# EAGLE design nhs hull (EAGLE 5.10)
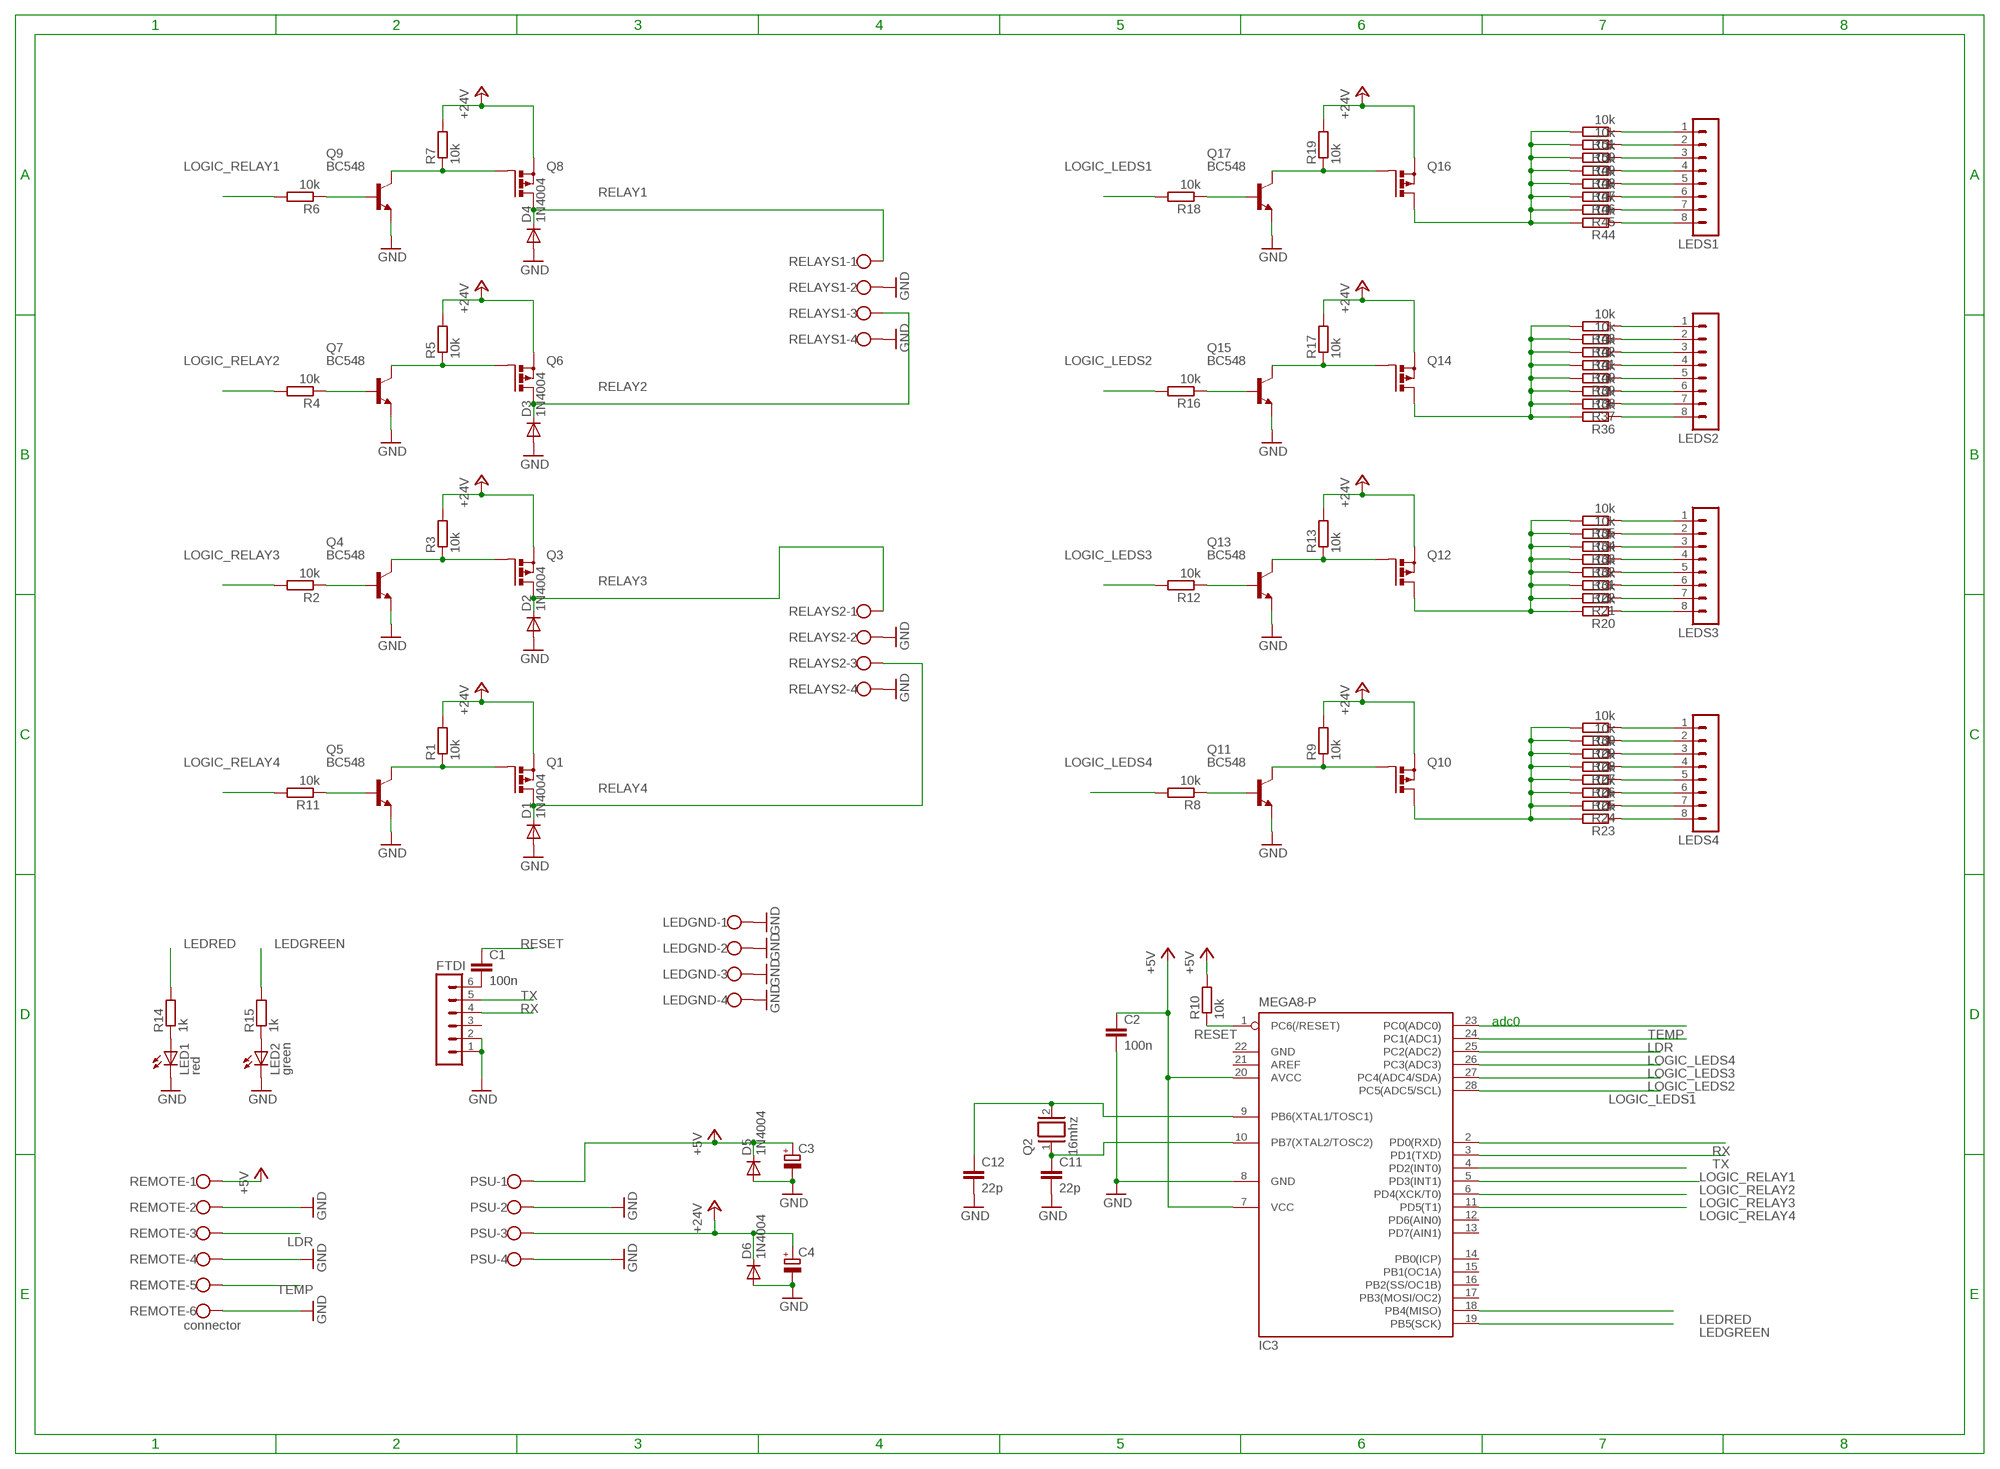
[diagram p0: schematic, sheet 1]

## Parts
C1  100n  C5/2.5  [C5B2.5]
C2  100n  C5/2.5  [C5B2.5]
C3  CPOL-EUE3.5-10  [E3,5-10]
C4  CPOL-EUE3.5-10  [E3,5-10]
C11  22p  C-EU050-025X075  [C050-025X075]
C12  22p  C-EU050-025X075  [C050-025X075]
D1  1N4004  [DO41-10]
D2  1N4004  [DO41-10]
D3  1N4004  [DO41-10]
D4  1N4004  [DO41-10]
D5  1N4004  [DO41-10]
D6  1N4004  [DO41-10]
FTDI  MA06-1  [MA06-1]
IC3  MEGA8-P  [DIL28-3]
LED1  red  LED5MM  [LED5MM]
LED2  green  LED5MM  [LED5MM]
LEDGND  W237-4  [W237-4]
LEDS1  MA08-1  [MA08-1]
LEDS2  MA08-1  [MA08-1]
LEDS3  MA08-1  [MA08-1]
LEDS4  MA08-1  [MA08-1]
PSU  W237-4  [W237-4]
Q1  PMOSFET_PTO220BV  [TO220BV]
Q2  16mhz  XTAL/S  [QS]
Q3  PMOSFET_PTO220BV  [TO220BV]
Q4  BC548  [TO92-EBC]
Q5  BC548  [TO92-EBC]
Q6  PMOSFET_PTO220BV  [TO220BV]
Q7  BC548  [TO92-EBC]
Q8  PMOSFET_PTO220BV  [TO220BV]
Q9  BC548  [TO92-EBC]
Q10  PMOSFET_PTO220BV  [TO220BV]
Q11  BC548  [TO92-EBC]
Q12  PMOSFET_PTO220BV  [TO220BV]
Q13  BC548  [TO92-EBC]
Q14  PMOSFET_PTO220BV  [TO220BV]
Q15  BC548  [TO92-EBC]
Q16  PMOSFET_PTO220BV  [TO220BV]
Q17  BC548  [TO92-EBC]
R1  10k  R-EU_0204/7  [0204/7]
R2  10k  R-EU_0204/7  [0204/7]
R3  10k  R-EU_0204/7  [0204/7]
R4  10k  R-EU_0204/7  [0204/7]
R5  10k  R-EU_0204/7  [0204/7]
R6  10k  R-EU_0204/7  [0204/7]
R7  10k  R-EU_0204/7  [0204/7]
R8  10k  R-EU_0204/7  [0204/7]
R9  10k  R-EU_0204/7  [0204/7]
R10  10k  R-EU_0204/7  [0204/7]
R11  10k  R-EU_0204/7  [0204/7]
R12  10k  R-EU_0204/7  [0204/7]
R13  10k  R-EU_0204/7  [0204/7]
R14  1k  R-EU_0204/7  [0204/7]
R15  1k  R-EU_0204/7  [0204/7]
R16  10k  R-EU_0204/7  [0204/7]
R17  10k  R-EU_0204/7  [0204/7]
R18  10k  R-EU_0204/7  [0204/7]
R19  10k  R-EU_0204/7  [0204/7]
R20  10k  R-EU_0204/7  [0204/7]
R21  10k  R-EU_0204/7  [0204/7]
R22  10k  R-EU_0204/7  [0204/7]
R23  10k  R-EU_0204/7  [0204/7]
R24  10k  R-EU_0204/7  [0204/7]
R25  10k  R-EU_0204/7  [0204/7]
R26  10k  R-EU_0204/7  [0204/7]
R27  10k  R-EU_0204/7  [0204/7]
R28  10k  R-EU_0204/7  [0204/7]
R29  10k  R-EU_0204/7  [0204/7]
R30  10k  R-EU_0204/7  [0204/7]
R31  10k  R-EU_0204/7  [0204/7]
R32  10k  R-EU_0204/7  [0204/7]
R33  10k  R-EU_0204/7  [0204/7]
R34  10k  R-EU_0204/7  [0204/7]
R35  10k  R-EU_0204/7  [0204/7]
R36  10k  R-EU_0204/7  [0204/7]
R37  10k  R-EU_0204/7  [0204/7]
R38  10k  R-EU_0204/7  [0204/7]
R39  10k  R-EU_0204/7  [0204/7]
R40  10k  R-EU_0204/7  [0204/7]
R41  10k  R-EU_0204/7  [0204/7]
R42  10k  R-EU_0204/7  [0204/7]
R43  10k  R-EU_0204/7  [0204/7]
R44  10k  R-EU_0204/7  [0204/7]
R45  10k  R-EU_0204/7  [0204/7]
R46  10k  R-EU_0204/7  [0204/7]
R47  10k  R-EU_0204/7  [0204/7]
R48  10k  R-EU_0204/7  [0204/7]
R49  10k  R-EU_0204/7  [0204/7]
R50  10k  R-EU_0204/7  [0204/7]
R51  10k  R-EU_0204/7  [0204/7]
RELAYS1  W237-4  [W237-4]
RELAYS2  W237-4  [W237-4]
REMOTE  connector  W237-6  [W237-6]

## Nets
+5V: C2.1 C3.+ D5.C IC3.7(VCC) IC3.20(AVCC) PSU.1 R10.2 REMOTE.1
+24V [power]: C4.+ D6.C PSU.3 Q1.S Q3.S Q6.S Q8.S Q10.S Q12.S Q14.S Q16.S R1.2 R3.2 R5.2 R7.2 R9.2 R13.2 R17.2 R19.2
GND: C2.2 C3.- C4.- C11.2 C12.2 D1.A D2.A D3.A D4.A D5.A D6.A FTDI.1 FTDI.2 IC3.8(GND) LED1.K(C) LED2.K(C) LEDGND.1 LEDGND.2 LEDGND.3 LEDGND.4 PSU.2 PSU.4 Q4.E Q5.E Q7.E Q9.E Q11.E Q13.E Q15.E Q17.E RELAYS1.2 RELAYS1.4 RELAYS2.2 RELAYS2.4 REMOTE.2 REMOTE.4 REMOTE.6
LDR [power]: IC3.24(PC1(ADC1)) REMOTE.3
LEDGREEN: IC3.19(PB5(SCK)) R15.2
LEDRED: IC3.18(PB4(MISO)) R14.2
LEDS4: Q10.D R23.2 R24.2 R25.2 R26.2 R27.2 R28.2 R29.2 R30.2
LOGIC_LEDS1: IC3.28(PC5(ADC5/SCL)) R18.2
LOGIC_LEDS2: IC3.27(PC4(ADC4/SDA)) R16.2
LOGIC_LEDS3: IC3.26(PC3(ADC3)) R12.2
LOGIC_LEDS4: IC3.25(PC2(ADC2)) R8.2
LOGIC_RELAY1: IC3.4(PD2(INT0)) R6.2
LOGIC_RELAY2: IC3.5(PD3(INT1)) R4.2
LOGIC_RELAY3: IC3.6(PD4(XCK/T0)) R2.2
LOGIC_RELAY4: IC3.11(PD5(T1)) R11.2
N$1: Q3.G Q4.C R3.1
N$2: Q1.G Q5.C R1.1
N$3: Q4.B R2.1
N$4: Q6.G Q7.C R5.1
N$5: C1.2 FTDI.6
N$6: Q7.B R4.1
N$7: Q8.G Q9.C R7.1
N$8: Q5.B R11.1
N$9: Q9.B R6.1
N$10: C11.1 IC3.10(PB7(XTAL2/TOSC2)) Q2.1
N$11: C12.1 IC3.9(PB6(XTAL1/TOSC1)) Q2.2
N$12: Q10.G Q11.C R9.1
N$13: LED1.A R14.1
N$14: Q11.B R8.1
N$15: LED2.A R15.1
N$16: Q12.G Q13.C R13.1
N$17: Q13.B R12.1
N$18: Q14.G Q15.C R17.1
N$19: Q15.B R16.1
N$20: Q16.G Q17.C R19.1
N$21: Q17.B R18.1
N$22: LEDS4.8 R23.1
N$23: LEDS4.7 R24.1
N$24: LEDS4.6 R25.1
N$27: LEDS4.5 R26.1
N$28: LEDS4.4 R27.1
N$29: LEDS4.3 R28.1
N$30: LEDS4.2 R29.1
N$31: LEDS4.1 R30.1
N$32: Q12.D R20.2 R21.2 R22.2 R31.2 R32.2 R33.2 R34.2 R35.2
N$33: LEDS3.8 R20.1
N$35: LEDS3.7 R21.1
N$37: LEDS3.6 R22.1
N$38: LEDS3.5 R31.1
N$39: LEDS3.4 R32.1
N$40: LEDS3.3 R33.1
N$41: LEDS3.2 R34.1
N$43: LEDS3.1 R35.1
N$44: Q14.D R36.2 R37.2 R38.2 R39.2 R40.2 R41.2 R42.2 R43.2
N$45: LEDS2.8 R36.1
N$46: LEDS2.7 R37.1
N$47: LEDS2.6 R38.1
N$48: LEDS2.5 R39.1
N$49: LEDS2.4 R40.1
N$50: LEDS2.3 R41.1
N$51: LEDS2.2 R42.1
N$52: LEDS2.1 R43.1
N$53: Q16.D R44.2 R45.2 R46.2 R47.2 R48.2 R49.2 R50.2 R51.2
N$54: LEDS1.8 R44.1
N$55: LEDS1.7 R45.1
N$56: LEDS1.6 R46.1
N$57: LEDS1.5 R47.1
N$58: LEDS1.4 R48.1
N$59: LEDS1.3 R49.1
N$60: LEDS1.2 R50.1
N$61: LEDS1.1 R51.1
RELAY1: D4.C Q8.D RELAYS1.1
RELAY2: D3.C Q6.D RELAYS1.3
RELAY3: D2.C Q3.D RELAYS2.1
RELAY4: D1.C Q1.D RELAYS2.3
RESET: C1.1 IC3.1(PC6(/RESET)) R10.1
RX: FTDI.4 IC3.2(PD0(RXD))
TEMP: IC3.23(PC0(ADC0)) REMOTE.5
TX: FTDI.5 IC3.3(PD1(TXD))
Unconnected: FTDI.3 IC3.12(PD6(AIN0)) IC3.13(PD7(AIN1)) IC3.14(PB0(ICP)) IC3.15(PB1(OC1A)) IC3.16(PB2(SS/OC1B)) IC3.17(PB3(MOSI/OC2)) IC3.21(AREF)

## Notes on the sheet
- adc0

## Power pins joined to a net without a drawn wire
GND: IC3.22(GND)

## Library data of the parts
C1 C2 = capacitor-wima:C: CAPACITOR naming: grid - package width
C3 C4 = rcl:CPOL-EU: POLARIZED CAPACITOR, European symbol
C11 C12 = rcl:C-EU: CAPACITOR, European symbol
D1-D6 = diode:1N4004: DIODE general purpose rectifier, 1 A
FTDI = con-lstb:MA06-1: PIN HEADER
IC3 = atmel:MEGA8-P: MICROCONTROLLER 8 Kbytes FLASH, 1 kbytes SRAM, 512 bytes EEPROM, USART, 4-channel 10 bit ADC, 2-channel 8 bit ADC Pin compatible with Atmega48, ATMega88, ATMega168 Source: avr.lbr
LED1 LED2 = led:LED: LED OSRAM: - CHIPLED LG R971, LG N971, LY N971, LG Q971, LY Q971, LO R971, LY R971 LH N974, LH R974 LS Q976, LO Q976, LY Q976 LO Q996 - Hyper CHIPLED LW Q18S LB Q993, LB Q99A, LB R99A - SideLED LS A670, LO A670, LY A670, LG A670, LP A670 LB A673, LV A673, LT A673, LW A673 LH A674 LY A675 LS A676, LA A676, LO A676, LY A676, LW A676 LS A679, LY A679, LG A679 - Hyper Micro SIDELED® LS Y876, LA Y876, LO Y876, LY Y876 LT Y87S - SmartLED LW L88C, LW L88S LB L89C, LB L89S, LG L890 LS L89K, LO L89K, LY L89K LS L896, LA L896, LO L896, LY L896 - TOPLED LS T670, LO T670, LY T670, LG T670, LP T670 LSG T670, LSP T670, LSY T670, LOP T670, LYG T670 LG T671, LOG T671, LSG T671 LB T673, LV T673, LT T673, LW T673 LH T674 LS T676, LA T676, LO T676, LY T676, LB T676, LH T676, LSB T676, LW T676 LB T67C, LV T67C, LT T67C, LS T67K, LO T67K, LY T67K, LW E67C LS E67B, LA E67B, LO E67B, LY E67B, LB E67C, LV E67C, LT E67C LW T67C LS T679, LY T679, LG T679 LS T770, LO T770, LY T770, LG T770, LP T770 LB T773, LV T773, LT T773, LW T773 LH T774 LS E675, LA E675, LY E675, LS T675 LS T776, LA T776, LO T776, LY T776, LB T776 LHGB T686 LT T68C, LB T68C - Hyper Mini TOPLED® LB M676 - Mini TOPLED Santana® LG M470 LS M47K, LO M47K, LY M47K Source: http://www.osram.convergy.de LUXEON: - LUMILED® LXK2-PW12-R00, LXK2-PW12-S00, LXK2-PW14-U00, LXK2-PW14-V00 LXK2-PM12-R00, LXK2-PM12-S00, LXK2-PM14-U00 LXK2-PE12-Q00, LXK2-PE12-R00, LXK2-PE12-S00, LXK2-PE14-T00, LXK2-PE14-U00 LXK2-PB12-K00, LXK2-PB12-L00, LXK2-PB12-M00, LXK2-PB14-N00, LXK2-PB14-P00, LXK2-PB14-Q00 LXK2-PR12-L00, LXK2-PR12-M00, LXK2-PR14-Q00, LXK2-PR14-R00 LXK2-PD12-Q00, LXK2-PD12-R00, LXK2-PD12-S00 LXK2-PH12-R00, LXK2-PH12-S00 LXK2-PL12-P00, LXK2-PL12-Q00, LXK2-PL12-R00 Source: www.luxeon.com KINGBRIGHT: KA-3528ASYC Source: www.kingbright.com
LEDGND PSU RELAYS1 RELAYS2 = con-wago-500:W237-4: WAGO SCREW CLAMP
LEDS1-LEDS4 = con-lstb:MA08-1: PIN HEADER
Q1 Q3 Q6 Q8 Q10 Q12 Q14 Q16 = transistor-power:PMOSFET_P: Power MOSFET P-Channel
Q2 = special:XTAL/S: CRYSTAL
Q4 Q5 Q7 Q9 Q11 Q13 Q15 Q17 = transistor-npn:BC548*: NPN Transistor
R1-R51 = rcl:R-EU_: RESISTOR, European symbol
REMOTE = con-wago-500:W237-6: WAGO SCREW CLAMP

## Net classes
1 power: width 2 mm

## Board
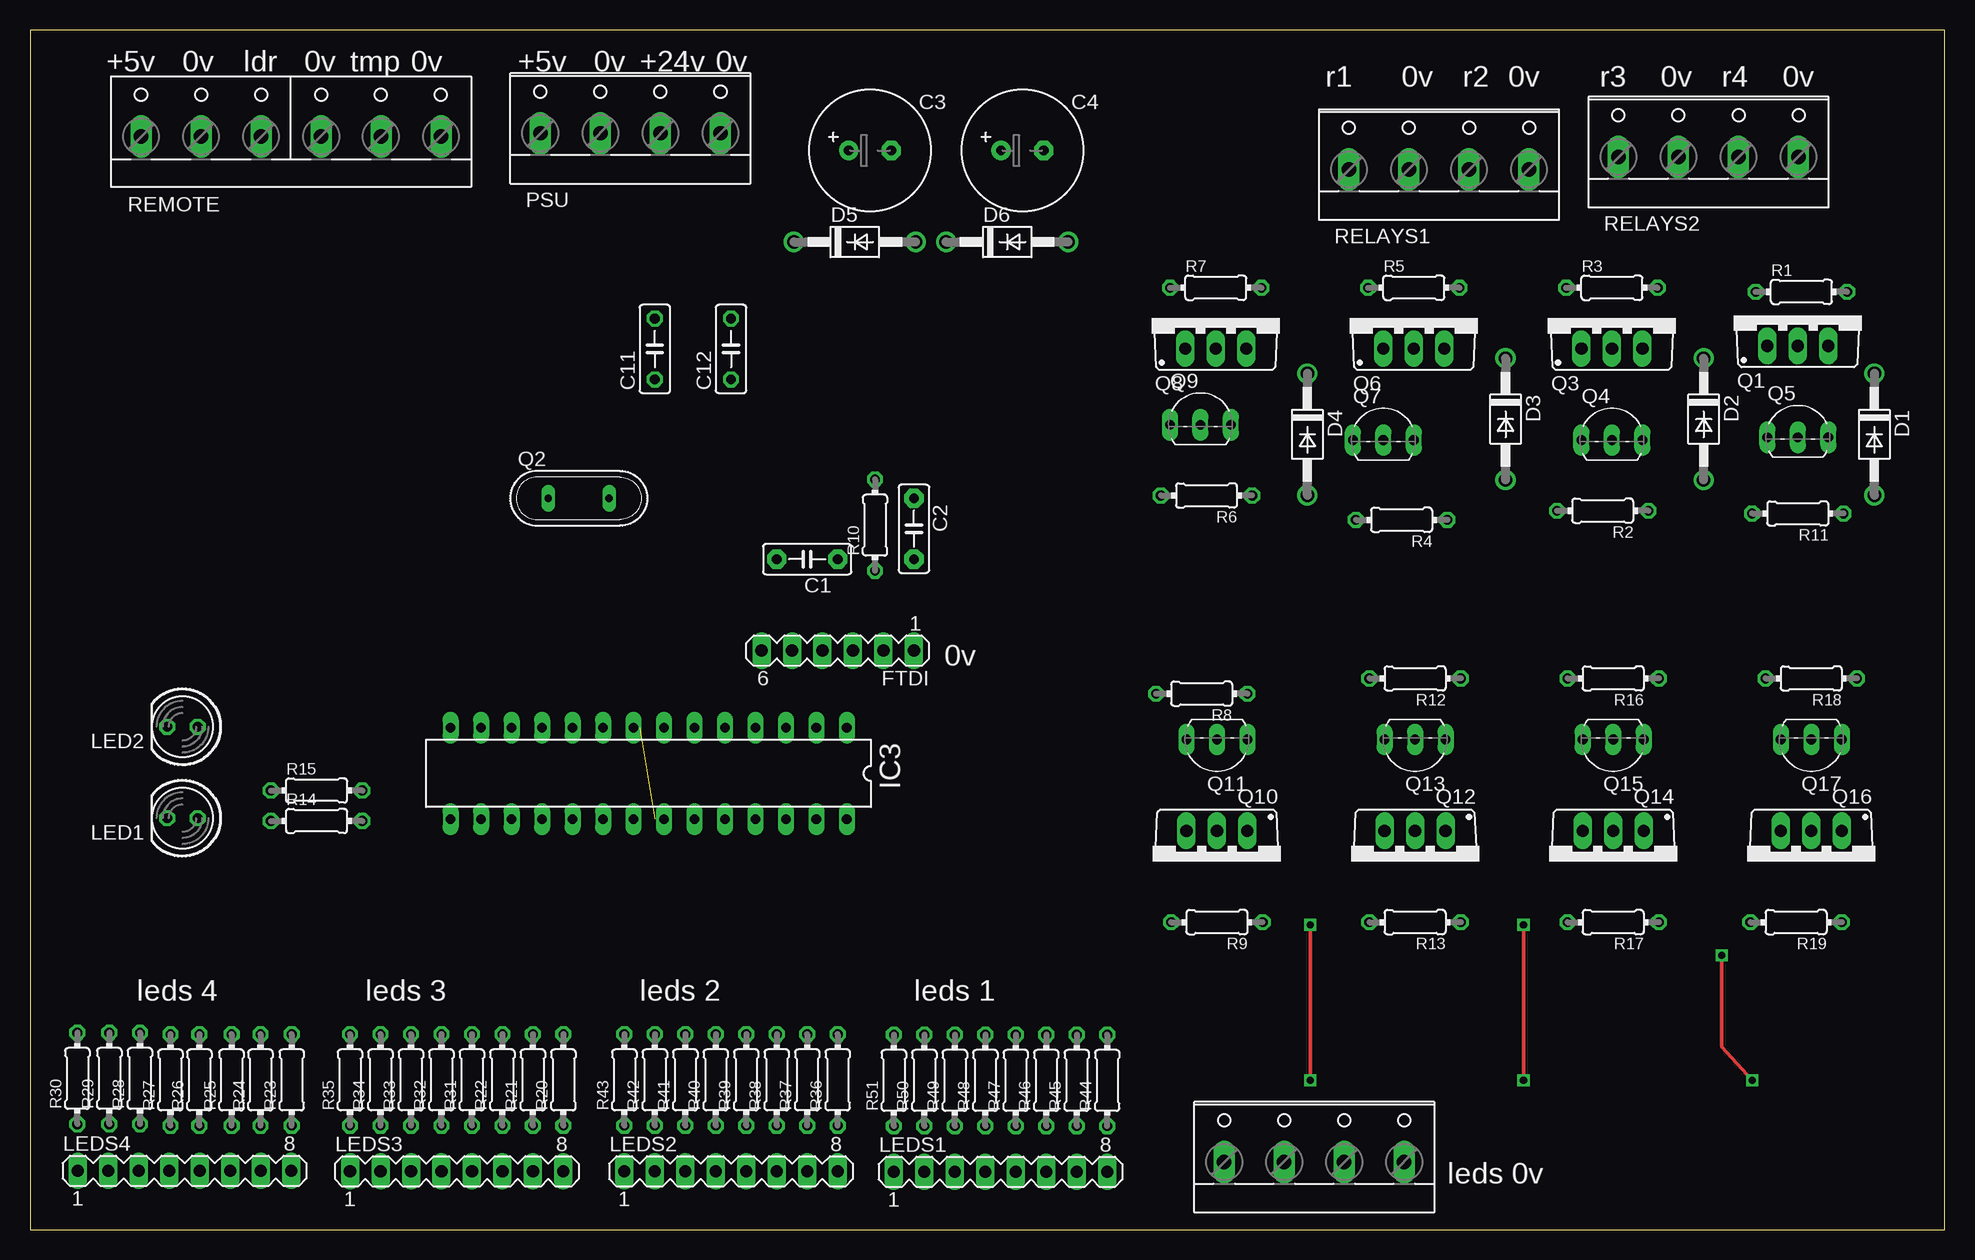
[diagram p1: board, top side]
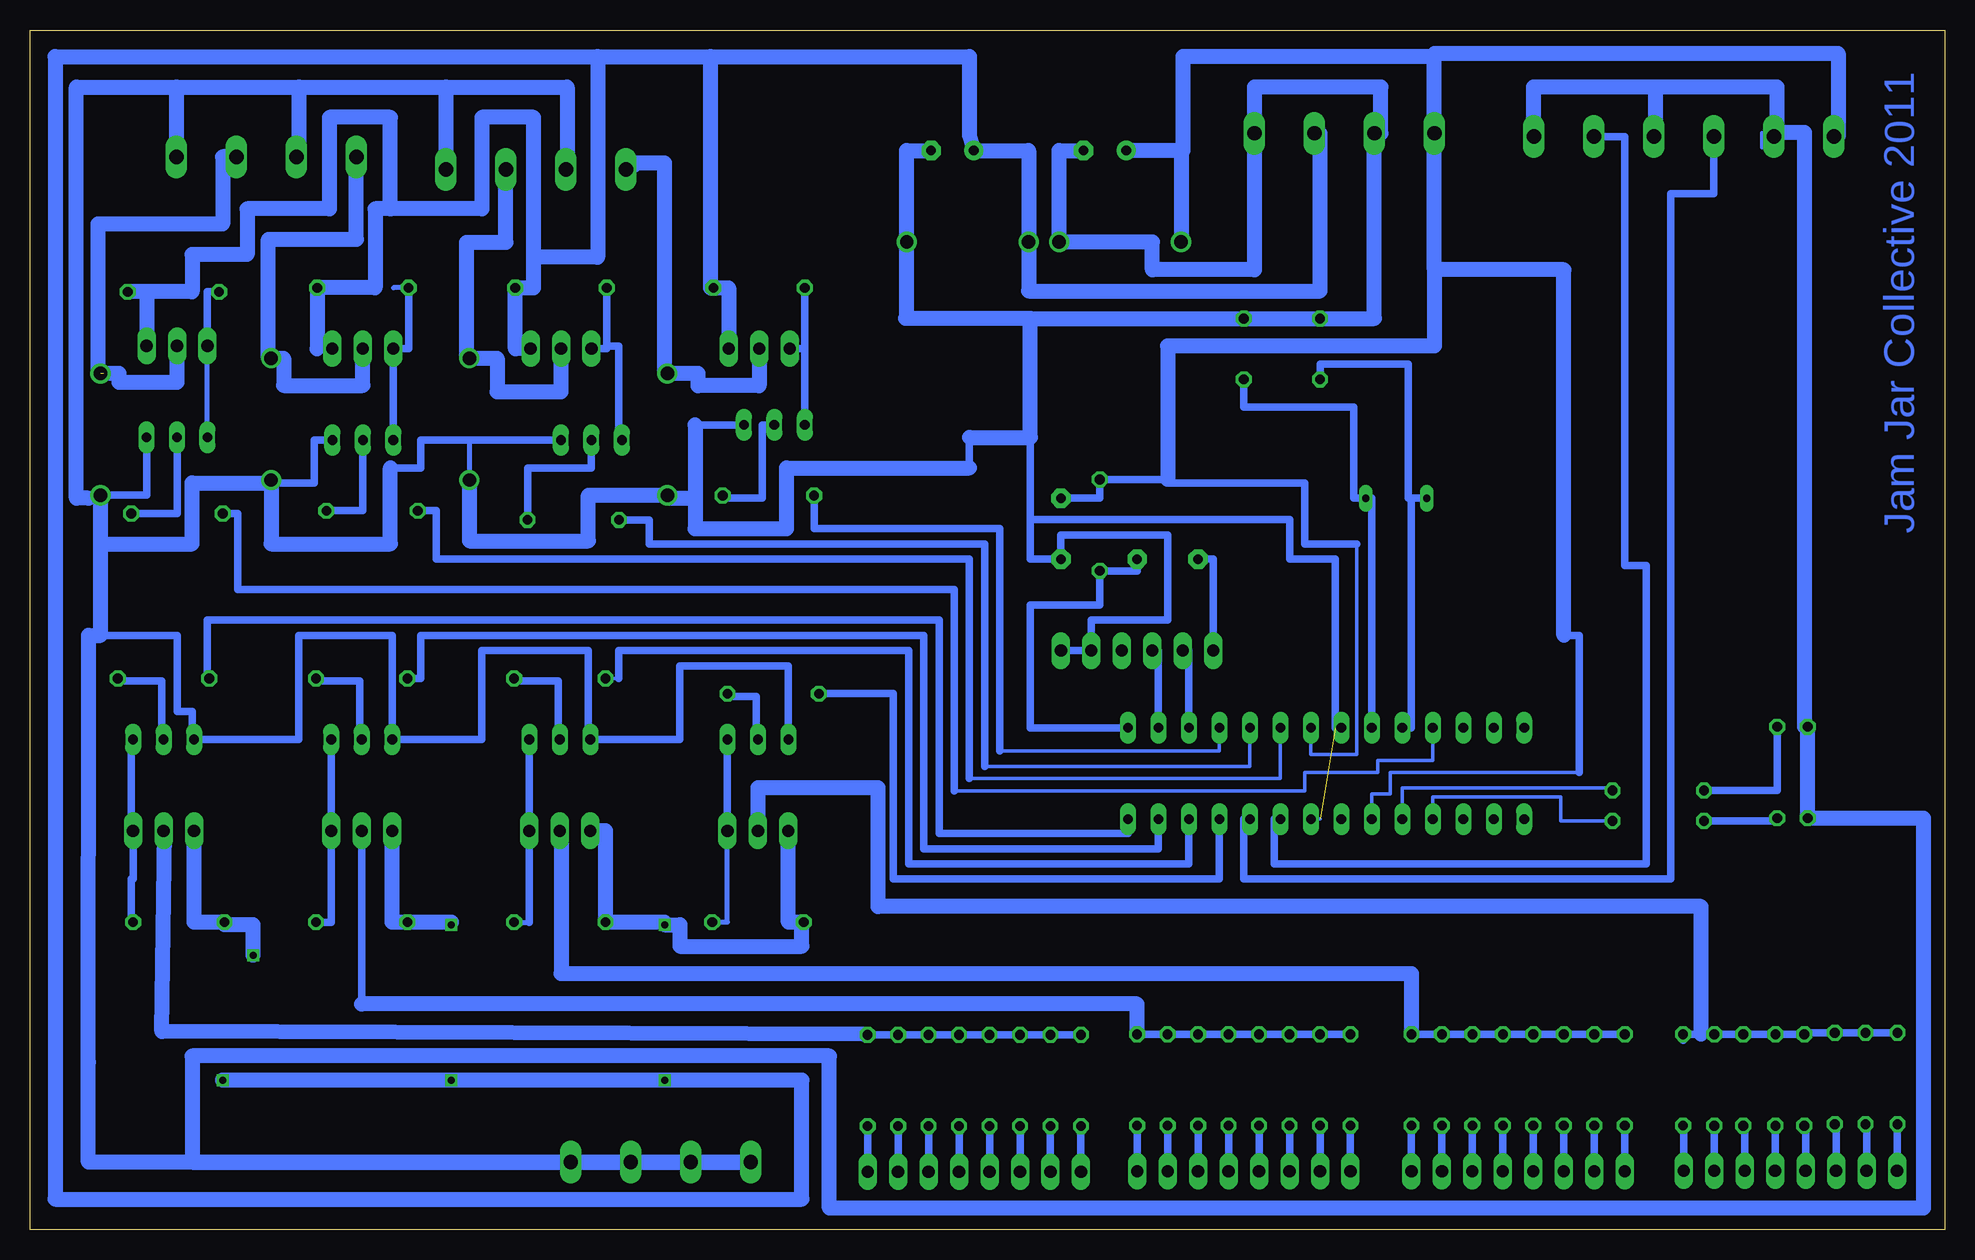
[diagram p2: board, bottom side, seen from below]

Size 159.57 x 100 mm. Coordinates in mm from the lower left corner, seen from the top.
Outline: 0,0 159.57,0 159.57,100 0,100 0,0
Copper layers (1*16): Top 0.035mm / dielectric 1.5mm / Bottom 0.035mm
Design rules "default": minimum track width 10mil, minimum drill 24mil, track to track 8mil, track to pad 8mil, pad to pad 8mil, via to via 8mil, smd to smd 8mil, copper to edge 40mil, drill to drill 8mil, minimum pad ring 10mil, minimum via ring 8mil, stop-mask expansion 4mil, vias tented up to drill 0mil, thermal gap 10mil

### Footprints (pad centres in the part's own frame; a part is rotated, then mirrored left to right if it is on the bottom)
C5B2.5 = drill 0.813 pad 1.6 octagon: 1 -2.54,0; 2 2.54,0
E3,5-10 = drill 0.813 pad 1.6 round: + -1.778,0 | drill 0.813 pad 1.6 octagon: - 1.778,0
C050-025X075 = drill 0.813 octagon: 1 -2.54,0; 2 2.54,0
DO41-10 = drill 1.118 round: A 5.08,0; C -5.08,0
MA06-1 = drill 1.016 long: 1 -6.35,0; 2 -3.81,0; 3 -1.27,0; 4 1.27,0; 5 3.81,0; 6 6.35,0
DIL28-3 = drill 0.813 long: 1 -16.51,-3.81; 2 -13.97,-3.81; 3 -11.43,-3.81; 4 -8.89,-3.81; 5 -6.35,-3.81; 6 -3.81,-3.81; 7 -1.27,-3.81; 8 1.27,-3.81; 9 3.81,-3.81; 10 6.35,-3.81; 11 8.89,-3.81; 12 11.43,-3.81; 13 13.97,-3.81; 14 16.51,-3.81; 15 16.51,3.81; 16 13.97,3.81; 17 11.43,3.81; 18 8.89,3.81; 19 6.35,3.81; 20 3.81,3.81; 21 1.27,3.81; 22 -1.27,3.81; 23 -3.81,3.81; 24 -6.35,3.81; 25 -8.89,3.81; 26 -11.43,3.81; 27 -13.97,3.81; 28 -16.51,3.81
LED5MM = drill 0.813 octagon: A -1.27,0; K 1.27,0
W237-4 = drill 1.194 long: 1 -7.5,-1.27; 2 -2.5,-1.27; 3 2.5,-1.27; 4 7.5,-1.27
MA08-1 = drill 1.016 long: 1 -8.89,0; 2 -6.35,0; 3 -3.81,0; 4 -1.27,0; 5 1.27,0; 6 3.81,0; 7 6.35,0; 8 8.89,0
TO220BV = drill 1.016 long: D 0,-2.54; G -2.54,-2.54; S 2.54,-2.54
QS = drill 0.61 long: 1 -2.54,0; 2 2.54,0
TO92-EBC = drill 0.813 long: B 0,-1.27; C -2.54,-1.27; E 2.54,-1.27
0204/7 = drill 0.813 octagon: 1 -3.81,0; 2 3.81,0
W237-6 = drill 1.194 long: 1 -12.5,-1.27; 2 -7.5,-1.27; 3 -2.5,-1.27; 4 2.5,-1.27; 5 7.5,-1.27; 6 12.5,-1.27

### Placement (x,y rotation side)
C1  64.77,55.88 180 top
C2  73.66,58.42 270 top
C3  70,89.95 0 top
C4  82.7,89.95 0 top
C11  52.07,73.41 90 top
C12  58.42,73.41 90 top
D1  153.69,66.29 270 top
D2  139.47,67.56 270 top
D3  122.96,67.56 270 top
D4  106.45,66.29 270 top
D5  68.73,82.33 0 top
D6  81.43,82.33 0 top
FTDI  67.31,48.26 180 top
IC3  51.56,38.02 180 top
LED1  12.7,34.29 180 top
LED2  12.7,41.91 180 top
LEDGND  107.01,6.89 0 top
LEDS1  80.88,4.8 0 top
LEDS2  58.42,4.85 0 top
LEDS3  35.56,4.85 0 top
LEDS4  12.88,4.89 0 top
PSU  50.03,92.66 0 top
Q1  147.32,76.2 0 top
Q2  45.72,60.96 0 top
Q3  131.83,75.97 0 top
Q4  131.83,67.08 0 top
Q5  147.32,67.31 0 top
Q6  115.32,75.97 0 top
Q7  112.78,67.08 0 top
Q8  98.81,75.97 0 top
Q9  97.54,68.35 0 top
Q10  98.91,30.7 180 top
Q11  98.91,39.59 180 top
Q12  115.42,30.7 180 top
Q13  115.42,39.59 180 top
Q14  131.93,30.7 180 top
Q15  131.93,39.59 180 top
Q16  148.44,30.7 180 top
Q17  148.44,39.59 180 top
R1  147.62,78.17 0 top
R2  131.06,59.92 180 top
R3  131.83,78.51 0 top
R4  114.3,59.16 180 top
R5  115.32,78.51 0 top
R6  98.04,61.19 180 top
R7  98.81,78.51 0 top
R8  97.64,44.67 180 top
R9  98.91,25.62 180 top
R10  70.42,58.72 90 top
R11  147.32,59.69 180 top
R12  115.42,45.94 180 top
R13  115.42,25.62 180 top
R14  23.88,34.06 0 top
R15  23.88,36.6 0 top
R16  131.93,45.94 180 top
R17  131.93,25.62 180 top
R18  148.44,45.94 180 top
R19  147.17,25.62 180 top
R20  44.45,12.47 90 top
R21  41.91,12.47 90 top
R22  39.37,12.47 90 top
R23  21.81,12.47 90 top
R24  19.21,12.46 90 top
R25  16.8,12.46 90 top
R26  14.12,12.46 90 top
R27  11.71,12.46 90 top
R28  9.17,12.59 90 top
R29  6.61,12.59 90 top
R30  3.95,12.59 90 top
R31  36.83,12.47 90 top
R32  34.29,12.47 90 top
R33  31.75,12.47 90 top
R34  29.21,12.47 90 top
R35  26.67,12.47 90 top
R36  67.31,12.47 90 top
R37  64.77,12.47 90 top
R38  62.23,12.47 90 top
R39  59.69,12.47 90 top
R40  57.15,12.47 90 top
R41  54.61,12.47 90 top
R42  52.07,12.47 90 top
R43  49.53,12.47 90 top
R44  89.77,12.43 90 top
R45  87.23,12.43 90 top
R46  84.69,12.43 90 top
R47  82.15,12.43 90 top
R48  79.61,12.43 90 top
R49  77.07,12.43 90 top
R50  74.53,12.43 90 top
R51  71.99,12.43 90 top
RELAYS1  117.41,89.64 0 top
RELAYS2  139.87,90.69 0 top
REMOTE  21.75,92.39 0 top

### Tracks (layer width: path | path; a pad name or v marks a point on that pad's centre or on a via)
+5V
  Bottom 0.305: IC3.7 52.83,39.62 49.02,39.62 49.02,57.15 | 64.77,62.53 64.77,62.23 | 48.26,34.21 IC3.20 47.75,36.32 46.23,36.32 46.23,38.1 30.48,38.1
  Bottom 0.406: C3.+ 63.65,89.95
  Bottom 0.61: C2.1 70.42,60.96 R10.2 64.77,62.53 | 49.02,57.15 53.34,57.15 53.34,62.23 64.77,62.23 | 30.48,38.1 30.48,49.53 31.75,49.53
  Bottom 1.27: 63.65,89.95 D5.C | C3.+ 63.5,89.95 63.5,97.79 42.53,97.79 | 42.53,97.79 PSU.1 42.53,80.01 | REMOTE.1 8.89,91.12 8.89,98.04 42.53,98.04 42.53,97.79 | 64.77,62.53 64.77,73.66 42.53,73.66 42.53,80.01 | 31.75,49.53 31.75,80.01 42.53,80.01
+24V  (via drill 0.6)
  Top 0.305: v143.51,12.45 140.97,15.24 v140.97,22.86 | v124.46,12.45 v124.46,25.4 | v106.68,12.45 v106.68,25.4
  Bottom 0.305: 143.36,25.4 R19.2 | v124.46,25.4 124.46,25.62 | 102.87,78.51 R7.2 | 95.25,25.62 R9.2
  Bottom 0.406: 52.07,91.39 PSU.3 | 129.39,25.62 R17.2
  Bottom 0.61: 135.64,73.43 Q3.S
  Bottom 1.27: R7.2 101.35,78.51 Q8.S | 149.86,78.17 R1.2 | 149.86,78.17 Q1.S | 149.86,78.17 146.05,78.17 146.05,81.28 141.48,81.28 141.48,85.09 134.62,85.09 134.62,92.71 129.54,92.71 129.54,85.09 | 52.07,91.39 52.07,78.23 76.35,78.23 D6.C 76.35,89.95 C4.+ 81.28,91.22 81.28,97.79 102.87,97.79 | Q12.S 111.61,33.24 R13.2 106.68,25.62 v106.68,25.4 105.41,25.4 105.41,23.62 95.25,23.62 95.25,25.62 | R9.2 96.37,25.62 Q10.S | Q14.S 129.39,25.62 124.46,25.62 | R19.2 145.9,25.62 Q16.S | Q6.S 119.13,73.43 R5.2 117.6,78.51 117.6,81.05 | 135.64,73.43 R3.2 130.81,78.51 130.81,85.09 129.54,85.09 | 129.54,85.09 121.92,85.09 121.92,92.71 117.6,92.71 117.6,81.05 | 112.27,97.79 157.48,97.79 157.48,2.54 95.25,2.54 95.25,12.45 v106.68,12.45 v124.46,12.45 v143.51,12.45 | 112.27,97.79 102.87,97.79 | v140.97,22.86 140.97,25.4 143.36,25.4 | 102.87,97.79 102.87,78.51 | 112.27,97.79 112.27,81.05 117.6,81.05
GND  (1 unrouted)
  Bottom 0.305: 34.29,91.12 REMOTE.6 | 24.13,91.12 REMOTE.4 24.25,95.25 24.13,95.25 | 13.97,91.44 13.97,90.17 15.24,90.17 15.24,91.44 14.25,91.44 REMOTE.2 | PSU.2 46.99,91.39 | IC3.22 52.07,34.21 | 50.8,41.83 IC3.8 | D1.A 154.71,60.96
  Bottom 0.406: 104.14,60.96 104.14,67.08 | D4.A 106.45,60.96 | 114.81,88.37 RELAYS1.2 | 114.81,95.25 124.91,95.25 137.16,95.25 147.37,95.25 | 137.16,89.42 RELAYS2.2 | 139.47,62.23 D2.A | 122.96,65.81 D3.A | 146.05,40.86 Q17.E | 113.03,40.64 112.88,40.64 Q13.E
  Bottom 0.61: 104.14,67.08 Q9.E | D1.A 149.86,61.21 Q5.E | Q4.E 135.89,65.81 135.89,62.23 139.47,62.23 | Q7.E 122.96,65.81 127,65.81 127,63.5 129.54,63.5 | 146.05,40.86 146.05,43.18 147.32,43.18 147.32,49.53 153.69,49.53 | Q17.E 137.16,40.86 137.16,49.53 129.39,49.53 Q15.E 121.92,40.86 121.92,48.26 113.03,48.26 113.03,40.64 | Q13.E 105.41,40.86 105.41,46.99 96.37,46.99 Q11.E | FTDI.1 FTDI.2 71.12,50.8 64.77,50.8 64.77,57.91 73.66,57.91 C2.2 76.2,55.88 76.2,59.18 | 50.8,41.83 50.8,55.88 54.61,55.88 54.61,59.18 76.2,59.18 | 76.2,66.04 76.2,59.18 | 81.28,63.5 81.28,66.04
  Bottom 1.27: 106.45,60.96 104.14,60.96 | 114.81,88.37 114.81,95.25 155.7,95.25 155.7,60.96 154.71,60.96 | 124.91,95.25 RELAYS1.4 | 137.16,95.25 137.16,89.42 | 147.37,95.25 RELAYS2.4 | 139.47,62.23 146.05,62.23 146.05,57.15 153.69,57.15 | 153.69,57.15 D1.A | 129.54,63.5 129.54,57.15 139.47,57.15 D2.A | D4.A 113.03,61.21 113.03,57.4 122.96,57.4 D3.A | C4.- 86.51,89.95 D6.A 86.51,75.95 | C3.- 73.81,89.95 D5.A 66.04,82.33 66.04,80.01 57.53,80.01 PSU.4 57.53,95.25 46.99,95.25 46.99,91.39 | 76.2,75.95 C12.2 C11.2 47.53,75.95 PSU.2 | 153.69,57.15 153.69,49.53 154.69,49.53 154.69,48.26 154.71,13.97 154.71,5.62 LEDGND.4 LEDGND.3 LEDGND.2 LEDGND.1 146.05,5.62 146.05,14.48 92.96,14.48 92.96,1.78 1.78,1.78 1.78,34.29 LED1.K LED2.K 11.68,41.91 11.68,91.44 13.97,91.44 13.97,95.25 24.13,95.25 24.13,91.12 | 24.25,95.25 34.29,95.25 34.29,91.12 | 76.2,75.95 76.2,66.04 81.28,66.04 | 104.14,67.08 104.14,58.42 96.52,58.42 96.52,63.5 81.28,63.5 | 76.2,75.95 86.51,75.95 | 86.51,75.95 86.61,75.95
LDR
  Bottom 0.305: IC3.24 58.42,34.21
  Bottom 0.61: 58.42,34.21 58.42,29.21 22.86,29.21 22.86,86.36 19.25,86.36 REMOTE.3
LEDGREEN
  Bottom 0.305: IC3.19 45.21,36.83 27.69,36.83 R15.2
LEDRED
  Bottom 0.305: R14.2 32,34.06 32,36.07 42.67,36.07 IC3.18
LEDS4
  Bottom 0.305: 11.71,16.4 R27.2 | R23.2 20.32,16.28
  Bottom 0.61: R30.2 R29.2 R28.2 11.71,16.4 | R23.2 21.81,15.77 | R27.2 R26.2 R25.2 R24.2 R23.2
  Bottom 1.27: 20.32,16.28 20.32,26.92 88.9,26.92 88.9,36.83 98.91,36.83 Q10.D
LOGIC_LEDS1
  Bottom 0.305: 144.78,45.94 R18.2 | IC3.28 68.07,33.02
  Bottom 0.61: 144.78,45.94 144.78,50.8 83.82,50.8 83.82,33.02 68.07,33.02
LOGIC_LEDS2
  Bottom 0.61: R16.2 127,45.94 127,49.53 85.09,49.53 85.09,31.75 65.53,31.75 IC3.27
LOGIC_LEDS3
  Bottom 0.305: 110.49,45.94 R12.2
  Bottom 0.61: 110.49,45.94 110.49,48.26 86.36,48.26 86.36,30.48 62.99,30.48 IC3.26
LOGIC_LEDS4
  Bottom 0.61: R8.2 87.63,44.67 87.63,29.21 60.45,29.21 IC3.25
LOGIC_RELAY1
  Bottom 0.305: IC3.4 60.45,39.88 78.74,39.88
  Bottom 0.61: 78.74,39.88 78.74,58.42 94.23,58.42 R6.2
LOGIC_RELAY2
  Bottom 0.305: 80.01,38.61 57.91,38.61 IC3.5
  Bottom 0.61: R4.2 107.95,59.16 107.95,57.15 80.01,57.15 80.01,38.61
LOGIC_RELAY3
  Bottom 0.305: 81.28,37.59 55.37,37.59 IC3.6
  Bottom 0.61: R2.2 125.73,59.92 125.73,55.88 81.28,55.88 81.28,37.59
LOGIC_RELAY4
  Bottom 0.305: IC3.11 42.67,41.91 42.67,39.12 47.24,39.12 47.24,38.1 53.34,38.1 53.34,36.58 82.55,36.58
  Bottom 0.61: R11.2 142.24,59.69 142.24,53.34 82.55,53.34 82.55,36.58
N$1
  Bottom 0.406: R3.1 129.29,78.51
  Bottom 0.61: Q4.C Q3.G 128.02,73.43 R3.1
N$2
  Bottom 0.406: Q5.C Q1.G
  Bottom 0.61: R1.1 144.78,78.17 Q1.G
N$3
  Bottom 0.61: R2.1 131.83,59.92 Q4.B
N$4
  Bottom 0.305: Q7.C 110.49,65.81
  Bottom 0.61: Q6.G 111.51,73.43 111.51,73.66 | 111.51,73.66 R5.1 | 110.49,65.81 110.49,73.66 111.51,73.66
N$5
  Bottom 0.61: FTDI.6 60.96,55.88 C1.2
N$6
  Bottom 0.305: R4.1 118.11,59.92
  Bottom 0.61: 118.11,59.92 118.11,63.5 112.78,63.5 Q7.B
N$7
  Bottom 0.61: 95,73.43 R7.1 | Q8.G 95,73.43 | 95,73.43 Q9.C
N$8
  Bottom 0.61: Q5.B 147.32,59.69 R11.1
N$9
  Bottom 0.61: Q9.B 98.55,67.08 98.55,60.96 101.85,60.96 R6.1
N$10
  Bottom 0.305: IC3.10 44.45,41.83 | 44.45,60.96 Q2.1
  Bottom 0.61: 44.45,41.83 44.45,60.96 | Q2.1 44.7,60.96 44.7,72.14 52.07,72.14 C11.1
N$11
  Bottom 0.61: IC3.9 47.75,60.96 Q2.2 49.28,60.96 49.28,68.58 58.42,68.58 C12.1
N$12
  Bottom 0.406: R9.1 101.45,25.62 Q10.G
  Bottom 0.61: Q10.G Q11.C
N$13
  Bottom 0.305: 13.97,34.06 LED1.A
  Bottom 0.61: R14.1 13.97,34.06
N$14
  Bottom 0.305: Q11.B 99.06,40.86 | 101.45,44.45 R8.1
  Bottom 0.61: 99.06,40.86 99.06,44.45 101.45,44.45
N$15
  Bottom 0.61: R15.1 13.97,36.6 LED2.A
N$16
  Bottom 0.406: R13.1 117.96,25.62
  Bottom 0.61: 117.96,25.62 Q12.G Q13.C
N$17
  Bottom 0.406: Q13.B 115.57,40.86 | 119.23,45.72 R12.1
  Bottom 0.61: 115.57,40.86 115.57,45.72 119.23,45.72
N$18
  Bottom 0.61: R17.1 134.47,25.62 Q14.G Q15.C
N$19
  Bottom 0.406: Q15.B 132.08,40.86 | 135.74,45.72 R16.1
  Bottom 0.61: 132.08,40.86 132.08,45.72 135.74,45.72
N$20
  Bottom 0.406: R19.1 151.13,25.62 | 151.13,29.21 150.98,29.21 | Q16.G 151.13,33.24 | 151.13,40.64 150.98,40.64 Q17.C
  Bottom 0.61: 151.13,25.62 151.13,29.21 | 150.98,29.21 Q16.G | 151.13,33.24 151.13,40.64
N$21
  Bottom 0.406: Q17.B 148.59,40.86 | 152.25,45.72 R18.1
  Bottom 0.61: 148.59,40.86 148.59,45.72 152.25,45.72
N$22
  Bottom 0.61: R23.1 21.77,8.66 LEDS4.8
N$23
  Bottom 0.61: R24.1 19.23,8.65 LEDS4.7
N$24
  Bottom 0.61: R25.1 16.69,8.65 LEDS4.6
N$27
  Bottom 0.61: R26.1 14.15,8.65 LEDS4.5
N$28
  Bottom 0.61: R27.1 11.61,8.65 LEDS4.4
N$29
  Bottom 0.61: R28.1 9.07,8.78 LEDS4.3
N$30
  Bottom 0.61: R29.1 6.53,8.78 LEDS4.2
N$31
  Bottom 0.61: LEDS4.1 3.95,4.89 R30.1
N$32
  Bottom 0.61: R35.2 R34.2 R33.2 R32.2 R31.2 R22.2 R21.2 R20.2
  Bottom 1.27: Q12.D 115.32,32.22 115.32,21.34 44.45,21.34 R20.2
N$33
  Bottom 0.61: R20.1 LEDS3.8
N$35
  Bottom 0.61: R21.1 LEDS3.7
N$37
  Bottom 0.61: R22.1 LEDS3.6
N$38
  Bottom 0.61: R31.1 LEDS3.5
N$39
  Bottom 0.61: R32.1 LEDS3.4
N$40
  Bottom 0.61: R33.1 LEDS3.3
N$41
  Bottom 0.61: R34.1 LEDS3.2
N$43
  Bottom 0.61: R35.1 LEDS3.1
N$44
  Bottom 0.61: R43.2 R42.2 R41.2 R40.2 R39.2 R38.2 R37.2 R36.2 | 131.93,18.8 Q14.D
  Bottom 1.27: R36.2 67.31,18.8 131.93,18.8
N$45
  Bottom 0.61: R36.1 LEDS2.8
N$46
  Bottom 0.61: R37.1 LEDS2.7
N$47
  Bottom 0.61: R38.1 LEDS2.6
N$48
  Bottom 0.61: R39.1 LEDS2.5
N$49
  Bottom 0.61: R40.1 LEDS2.4
N$50
  Bottom 0.61: R41.1 LEDS2.3
N$51
  Bottom 0.61: R42.1 LEDS2.2
N$52
  Bottom 0.61: R43.1 LEDS2.1
N$53
  Bottom 0.406: 148.34,33.24 Q16.D | 90.17,15.88 89.77,15.88 R44.2
  Bottom 0.61: R51.2 R50.2 R49.2 R48.2 R47.2 R46.2 R45.2 R44.2
  Bottom 1.27: 148.34,33.24 148.59,16.51 90.02,16.26 R44.2
N$54
  Bottom 0.61: R44.1 LEDS1.8
N$55
  Bottom 0.61: R45.1 LEDS1.7
N$56
  Bottom 0.61: R46.1 LEDS1.6
N$57
  Bottom 0.61: R47.1 LEDS1.5
N$58
  Bottom 0.61: R48.1 LEDS1.4
N$59
  Bottom 0.61: R49.1 LEDS1.3
N$60
  Bottom 0.61: R50.1 LEDS1.2
N$61
  Bottom 0.61: R51.1 LEDS1.1
RELAY1
  Bottom 0.305: D4.C 106.68,71.37 | 109.22,88.9 109.22,88.37
  Bottom 0.406: 108.99,88.37 109.22,88.37 RELAYS1.1
  Bottom 1.27: D4.C 106.43,71.37 103.89,71.37 103.89,70.35 98.81,70.35 Q8.D | 106.68,71.37 106.68,88.9 109.22,88.9
RELAY2
  Bottom 0.406: D3.C 123.19,72.64
  Bottom 1.27: 123.19,72.64 123.19,82.3 119.91,82.3 RELAYS1.3 | D3.C 120.65,72.64 120.65,69.85 115.32,69.85 Q6.D
RELAY3
  Bottom 0.406: D2.C 139.7,72.64
  Bottom 1.27: 139.7,72.64 139.7,82.55 132.37,82.55 RELAYS2.1 | D2.C 138.43,72.64 138.43,70.36 131.83,70.36 Q3.D
RELAY4  (1 unrouted)
  Bottom 0.406: 153.92,71.37 153.44,71.37
  Bottom 1.27: D1.C 152.15,71.37 152.15,70.61 147.32,70.61 Q1.D | RELAYS2.3 143.51,89.42 143.51,83.82 153.92,83.82 153.92,71.37
RESET
  Bottom 0.61: IC3.1 76.2,41.83 76.2,52.07 70.42,52.07 R10.1 67.31,54.91 C1.1
RX
  Bottom 0.305: FTDI.4 65.53,48.26
  Bottom 0.61: 65.53,48.26 IC3.2
TEMP
  Bottom 0.305: 55.88,34.21 IC3.23
  Bottom 0.61: 55.88,34.21 55.88,30.48 24.89,30.48 24.89,51.56 24.89,55.37 26.67,55.37 26.67,91.12 REMOTE.5
TX
  Bottom 0.305: FTDI.5 62.99,48.26
  Bottom 0.61: 62.99,48.26 IC3.3

### Text on the board
Bottom: Jam Jar Collective 2011
tPlace: +5v | 0v | ldr | 0v | tmp | 0v | +5v | 0v | +24v | 0v | r1 | 0v | r2 | 0v | r3 | 0v | r4 | 0v | 0v | leds 4 | leds 3 | leds 2 | leds 1 | leds 0v